# Altium schematic sheet FMCio_rowsEFJK.SchDoc
size Letter; PageSetup: Record=PageOptions|CenterHorizontal=True|CenterVertical=True|PrintScale=1.00|XCorrection=1.00|YCorrection=1.00|PrintKind=0|BorderSize=5000000|LeftOffset=0|BottomOffset=0|Orientation=2|PaperLength=1000|PaperWidth=1000|Scale=100|PaperSource=7|PrintQuality=-4|MediaType=1|DitherType=10|PaperKind=Letter|PrintScaleMode=1; Author: Adam Gilbert; CompanyName: McGill University; DrawnBy: Adam Gilbert; Organization: Altium Limited; Address1: McGill Cosmology; Address2: 3600 University Street; Address3: Montreal, Quebec; Address4: Canada; DocumentNumber: 13; Revision: Rev2; SheetNumber: 13; SheetTotal: 16; ProjectTitle: DfMux FMC Mezz; ModelNumber: MGMEZZ04; ProjectName: DfMux FMC Mezz
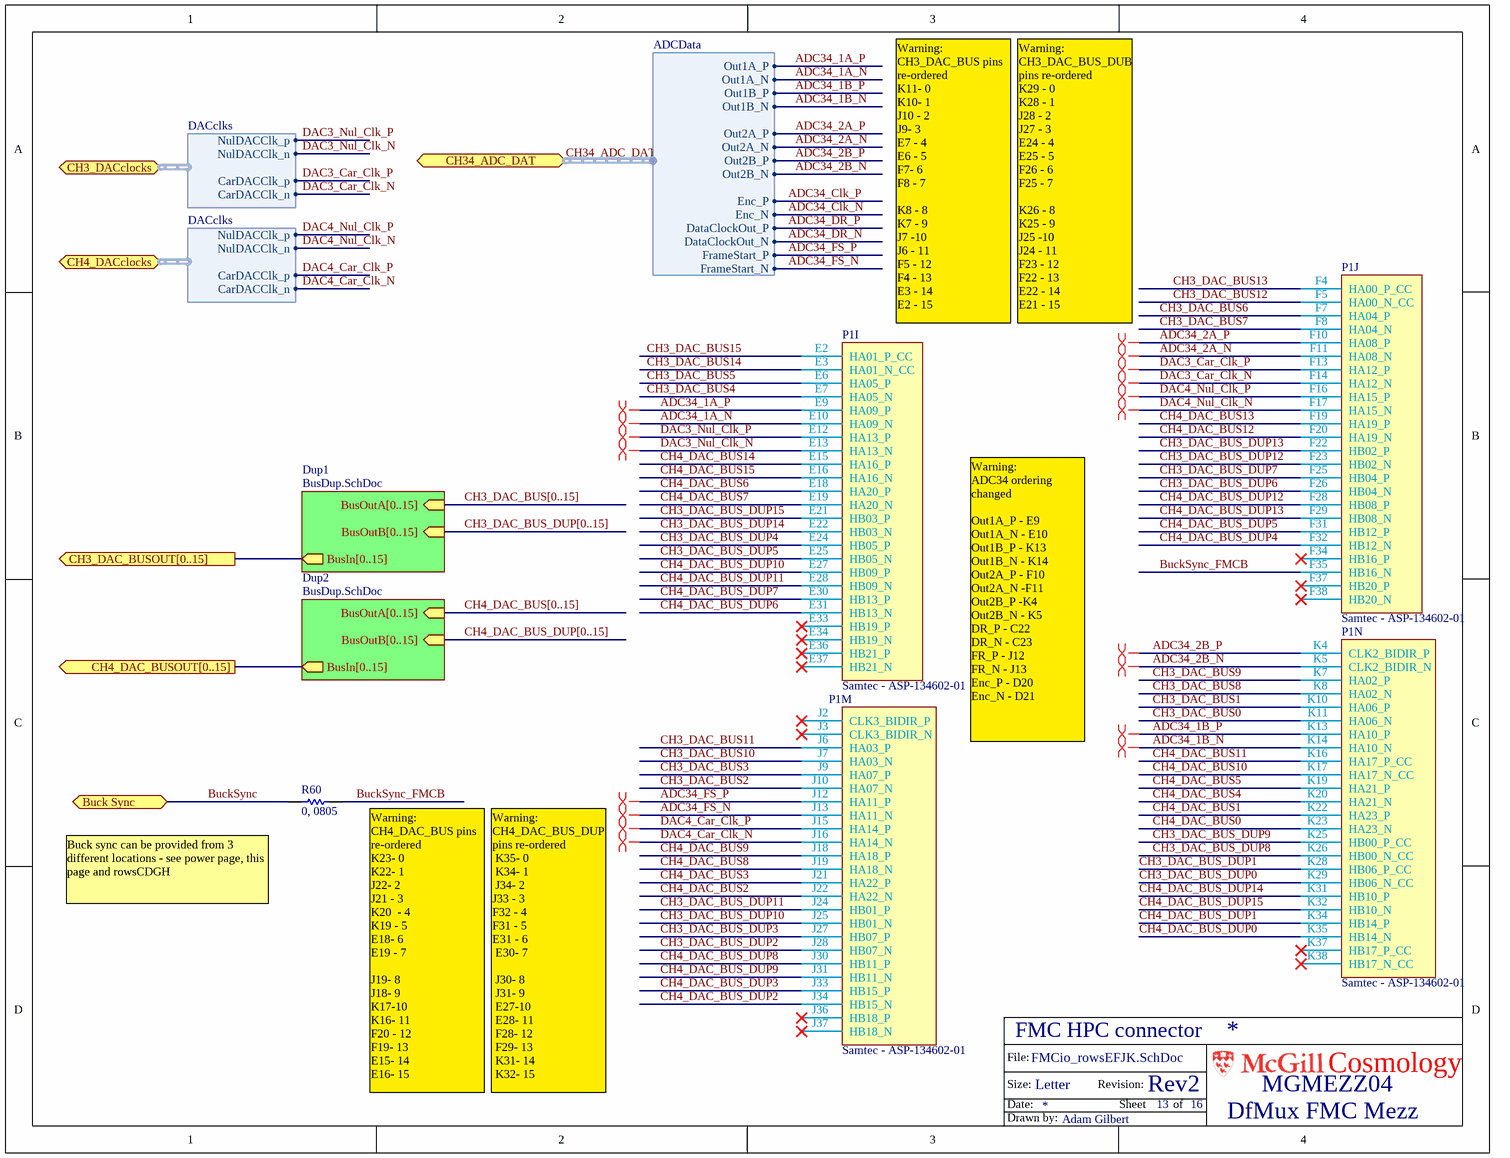
[diagram p0: FMCio_rowsEFJK.SchDoc]

## Parts
P1  Samtec - ASP-134602-01  [BTB-SM1-27-2V400M]  (parts I,J,M,N of 14)
R60  0, 0805  [0805]

## Sub-sheets
Dup1 = BusDup.SchDoc: BusIn[0..15] (out), BusOutA[0..15] (in), BusOutB[0..15] (in)
Dup2 = BusDup.SchDoc: BusIn[0..15] (out), BusOutA[0..15] (in), BusOutB[0..15] (in)

## Ports
Buck Sync, CH3_DAC_BUSOUT[0..15] (out), CH3_DACclocks (harness DACclks), CH4_DAC_BUSOUT[0..15] (out), CH4_DACclocks (harness DACclks), CH34_ADC_DAT (harness ADCData)

## Harnesses
ADCData: Enc_P, Enc_N, Out1A_P, Out1A_N, Out1B_P, Out1B_N, Out2A_P, Out2A_N, Out2B_P, Out2B_N, DataClockOut_P, DataClockOut_N, FrameStart_P, FrameStart_N
DACclks: NulDACClk_p, NulDACClk_n, CarDACClk_p, CarDACClk_n

## Nets
ADC34_1A_N: P1.E10(HA09_N) ; port CH34_ADC_DAT.Out1A_N
ADC34_1A_P: P1.E9(HA09_P) ; port CH34_ADC_DAT.Out1A_P
ADC34_1B_N: P1.K14(HA10_N) ; port CH34_ADC_DAT.Out1B_N
ADC34_1B_P: P1.K13(HA10_P) ; port CH34_ADC_DAT.Out1B_P
ADC34_2A_N: P1.F11(HA08_N) ; port CH34_ADC_DAT.Out2A_N
ADC34_2A_P: P1.F10(HA08_P) ; port CH34_ADC_DAT.Out2A_P
ADC34_2B_N: P1.K5(CLK2_BIDIR_N) ; port CH34_ADC_DAT.Out2B_N
ADC34_2B_P: P1.K4(CLK2_BIDIR_P) ; port CH34_ADC_DAT.Out2B_P
ADC34_Clk_N: port CH34_ADC_DAT.Enc_N
ADC34_Clk_P: port CH34_ADC_DAT.Enc_P
ADC34_DR_N: port CH34_ADC_DAT.DataClockOut_N
ADC34_DR_P: port CH34_ADC_DAT.DataClockOut_P
ADC34_FS_N: P1.J13(HA11_N) ; port CH34_ADC_DAT.FrameStart_N
ADC34_FS_P: P1.J12(HA11_P) ; port CH34_ADC_DAT.FrameStart_P
BuckSync: R60.2 ; port Buck Sync
BuckSync_FMCB: P1.F35(HB16_N) R60.1
CH3_DAC_BUS0: P1.K11(HA06_N)
CH3_DAC_BUS1: P1.K10(HA06_P)
CH3_DAC_BUS2: P1.J10(HA07_N)
CH3_DAC_BUS3: P1.J9(HA07_P)
CH3_DAC_BUS4: P1.E7(HA05_N)
CH3_DAC_BUS5: P1.E6(HA05_P)
CH3_DAC_BUS6: P1.F7(HA04_P)
CH3_DAC_BUS7: P1.F8(HA04_N)
CH3_DAC_BUS8: P1.K8(HA02_N)
CH3_DAC_BUS9: P1.K7(HA02_P)
CH3_DAC_BUS10: P1.J7(HA03_N)
CH3_DAC_BUS11: P1.J6(HA03_P)
CH3_DAC_BUS12: P1.F5(HA00_N_CC)
CH3_DAC_BUS13: P1.F4(HA00_P_CC)
CH3_DAC_BUS14: P1.E3(HA01_N_CC)
CH3_DAC_BUS15: P1.E2(HA01_P_CC)
CH3_DAC_BUS_DUP0: P1.K29(HB06_N_CC)
CH3_DAC_BUS_DUP1: P1.K28(HB06_P_CC)
CH3_DAC_BUS_DUP2: P1.J28(HB07_N)
CH3_DAC_BUS_DUP3: P1.J27(HB07_P)
CH3_DAC_BUS_DUP4: P1.E24(HB05_P)
CH3_DAC_BUS_DUP5: P1.E25(HB05_N)
CH3_DAC_BUS_DUP6: P1.F26(HB04_N)
CH3_DAC_BUS_DUP7: P1.F25(HB04_P)
CH3_DAC_BUS_DUP8: P1.K26(HB00_N_CC)
CH3_DAC_BUS_DUP9: P1.K25(HB00_P_CC)
CH3_DAC_BUS_DUP10: P1.J25(HB01_N)
CH3_DAC_BUS_DUP11: P1.J24(HB01_P)
CH3_DAC_BUS_DUP12: P1.F23(HB02_N)
CH3_DAC_BUS_DUP13: P1.F22(HB02_P)
CH3_DAC_BUS_DUP14: P1.E22(HB03_N)
CH3_DAC_BUS_DUP15: P1.E21(HB03_P)
CH4_DAC_BUS0: P1.K23(HA23_N)
CH4_DAC_BUS1: P1.K22(HA23_P)
CH4_DAC_BUS2: P1.J22(HA22_N)
CH4_DAC_BUS3: P1.J21(HA22_P)
CH4_DAC_BUS4: P1.K20(HA21_N)
CH4_DAC_BUS5: P1.K19(HA21_P)
CH4_DAC_BUS6: P1.E18(HA20_P)
CH4_DAC_BUS7: P1.E19(HA20_N)
CH4_DAC_BUS8: P1.J19(HA18_N)
CH4_DAC_BUS9: P1.J18(HA18_P)
CH4_DAC_BUS10: P1.K17(HA17_N_CC)
CH4_DAC_BUS11: P1.K16(HA17_P_CC)
CH4_DAC_BUS12: P1.F20(HA19_N)
CH4_DAC_BUS13: P1.F19(HA19_P)
CH4_DAC_BUS14: P1.E15(HA16_P)
CH4_DAC_BUS15: P1.E16(HA16_N)
CH4_DAC_BUS_DUP0: P1.K35(HB14_N)
CH4_DAC_BUS_DUP1: P1.K34(HB14_P)
CH4_DAC_BUS_DUP2: P1.J34(HB15_N)
CH4_DAC_BUS_DUP3: P1.J33(HB15_P)
CH4_DAC_BUS_DUP4: P1.F32(HB12_N)
CH4_DAC_BUS_DUP5: P1.F31(HB12_P)
CH4_DAC_BUS_DUP6: P1.E31(HB13_N)
CH4_DAC_BUS_DUP7: P1.E30(HB13_P)
CH4_DAC_BUS_DUP8: P1.J30(HB11_P)
CH4_DAC_BUS_DUP9: P1.J31(HB11_N)
CH4_DAC_BUS_DUP10: P1.E27(HB09_P)
CH4_DAC_BUS_DUP11: P1.E28(HB09_N)
CH4_DAC_BUS_DUP12: P1.F28(HB08_P)
CH4_DAC_BUS_DUP13: P1.F29(HB08_N)
CH4_DAC_BUS_DUP14: P1.K31(HB10_P)
CH4_DAC_BUS_DUP15: P1.K32(HB10_N)
DAC3_Car_Clk_N: P1.F14(HA12_N) ; port CH3_DACclocks.CarDACClk_n
DAC3_Car_Clk_P: P1.F13(HA12_P) ; port CH3_DACclocks.CarDACClk_p
DAC3_Nul_Clk_N: P1.E13(HA13_N) ; port CH3_DACclocks.NulDACClk_n
DAC3_Nul_Clk_P: P1.E12(HA13_P) ; port CH3_DACclocks.NulDACClk_p
DAC4_Car_Clk_N: P1.J16(HA14_N) ; port CH4_DACclocks.CarDACClk_n
DAC4_Car_Clk_P: P1.J15(HA14_P) ; port CH4_DACclocks.CarDACClk_p
DAC4_Nul_Clk_N: P1.F17(HA15_N) ; port CH4_DACclocks.NulDACClk_n
DAC4_Nul_Clk_P: P1.F16(HA15_P) ; port CH4_DACclocks.NulDACClk_p

Not connected (* = marked no-connect by the designer): P1 E33(HB19_P)* E34(HB19_N)* E36(HB21_P)* E37(HB21_N)* F34(HB16_P)* F37(HB20_P)* F38(HB20_N)* J2(CLK3_BIDIR_P)* J3(CLK3_BIDIR_N)* J36(HB18_P)* J37(HB18_N)* K37(HB17_P_CC)* K38(HB17_N_CC)*

## Buses and harness runs
bus CH3_DAC_BUS[0..15] = sheet Dup1/BusOutA[0..15]
bus CH3_DAC_BUS_DUP[0..15] = sheet Dup1/BusOutB[0..15]
bus CH4_DAC_BUS[0..15] = sheet Dup2/BusOutA[0..15]
bus CH4_DAC_BUS_DUP[0..15] = sheet Dup2/BusOutB[0..15]
bus port CH3_DAC_BUSOUT[0..15] = sheet Dup1/BusIn[0..15]
bus port CH4_DAC_BUSOUT[0..15] = sheet Dup2/BusIn[0..15]
harness CH34_ADC_DAT = port CH34_ADC_DAT

## Layout directives
differential pair: ADC34_1A_N, ADC34_1A_P, ADC34_1B_N, ADC34_1B_P, ADC34_2A_N, ADC34_2A_P, ADC34_2B_N, ADC34_2B_P, ADC34_FS_N, ADC34_FS_P, DAC3_Car_Clk_N, DAC3_Car_Clk_P, DAC3_Nul_Clk_N, DAC3_Nul_Clk_P, DAC4_Car_Clk_N, DAC4_Car_Clk_P, DAC4_Nul_Clk_N, DAC4_Nul_Clk_P

## Notes on the sheet
- Warning: CH3_DAC_BUS pins re-ordered
  K11- 0
  K10- 1
  J10 - 2
  J9- 3
  E7 - 4
  E6 - 5
  F7- 6
  F8 - 7
  K8 - 8
  K7 - 9
  J7 -10
  J6 - 11
  F5 - 12
  F4 - 13
  E3 - 14
  E2 - 15
- Warning: CH3_DAC_BUS_DUB pins re-ordered
  K29 - 0
  K28 - 1
  J28 - 2
  J27 - 3
  E24 - 4
  E25 - 5
  F26 - 6
  F25 - 7
  K26 - 8
  K25 - 9
  J25 -10
  J24 - 11
  F23 - 12
  F22 - 13
  E22 - 14
  E21 - 15
- Warning:
  ADC34 ordering changed
  Out1A_P - E9
  Out1A_N - E10
  Out1B_P - K13
  Out1B_N - K14
  Out2A_P - F10
  Out2A_N -F11 Out2B_P -K4
  Out2B_N - K5
  DR_P - C22
  DR_N - C23
  FR_P - J12
  FR_N - J13
  Enc_P - D20
  Enc_N - D21
- (near R60) Buck sync can be provided from 3 different locations - see power page, this page and rowsCDGH
- FMC HPC connector
- (near R60) Warning: CH4_DAC_BUS pins re-ordered
  K23- 0
  K22- 1
  J22- 2
  J21 - 3
  K20  - 4
  K19 - 5
  E18- 6
  E19 - 7
  J19- 8
  J18- 9
  K17-10
  K16- 11
  F20 - 12
  F19- 13
  E15- 14
  E16- 15
- Warning: CH4_DAC_BUS_DUP pins re-ordered
  K35- 0
  K34- 1
  J34- 2
  J33 - 3
  F32 - 4
  F31 - 5
  E31 - 6
  E30- 7
  J30- 8
  J31- 9
  E27-10
  E28- 11
  F28- 12
  F29- 13
  K31- 14
  K32- 15
- File:
- Size:
- Date:
- Letter
- Revision:
- Sheet
- of
- Cosmology
- Drawn by:

## Library data of the parts
P1 = Samtec - ASP-134602-01: Samtec ASP-134602-01; Assembly Comments: none; Manufacturer: Samtec; Part constraints: Samtec ASP-134602-01; Manufacturer Part Number 1: Samtec ASP-134602-01
R60 = Res1812: RES 0.0 OHM 1/8W 0805 SMD; Manufacturer: e.g Vishay/Dale; Part constraints: 0Ohm jumper, >=4A, 0805, <=5mOhms; Manufacturer Part Number 1: e.g CRCW08050000Z0EAHP; Value: 0; Assembly Comments: none; Supplier 1: Newark; Supplier Part Number 1: 68R2993